# Altium schematic sheet Sch_Add.SchDoc
size A
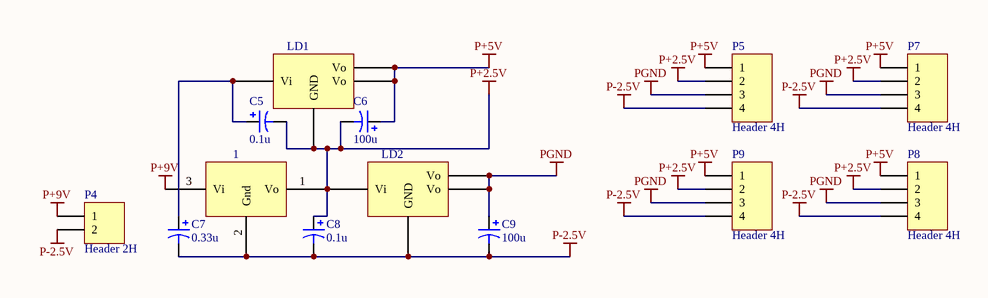
[diagram p0: Sch_Add.SchDoc]

## Parts
1  7805  [TO-92]  (value not drawn)
C5  value 0.1u  [C0805]  (hidden comment: Cap Pol3)
C6  value 100u  [C0805]  (hidden comment: Cap Pol3)
C7  value 0.33u  [C0805]  (hidden comment: Cap Pol3)
C8  value 0.1u  [C0805]  (hidden comment: Cap Pol3)
C9  value 100u  [C0805]  (hidden comment: Cap Pol3)
LD1  LD1117  [SOT230P700X180-4N]  (value not drawn)
LD2  LD1117  [SOT230P700X180-4N]  (value not drawn)
P4  Header 2H  [HDR1X2H]
P5  Header 4H  [HDR1X4H]
P7  Header 4H  [HDR1X4H]
P8  Header 4H  [HDR1X4H]
P9  Header 4H  [HDR1X4H]

## Nets
P+2.5V: 1.1(Vo) C5.2 C6.2 C8.1 LD1.1(GND) LD2.3(Vi) P5.2 P7.2 P8.2 P9.2
P+5V: C6.1 LD1.2(Vo) LD1.4(Vo) P5.1 P7.1 P8.1 P9.1
P+9V: 1.3(Vi) P4.1
P-2.5V: 1.2(Gnd) C7.2 C8.2 C9.2 LD2.1(GND) P4.2 P5.4 P7.4 P8.4 P9.4
PGND: C9.1 LD2.2(Vo) LD2.4(Vo) P5.3 P7.3 P8.3 P9.3
NetC5_1: C5.1 C7.1 LD1.3(Vi)

## Library data of the parts
C5-C9 = Cap Pol3: Polarized Capacitor (Surface Mount); Published: 8-Jun-2000; LatestRevisionDate: 29-May-2009; LatestRevisionNote: IPC-7351 Footprint Added.; PackageReference: C0805; Publisher: Altium Limited; PackageDescription: Chip Capacitor
P4 = Header 2H: Header, 2-Pin, Right Angle; LatestRevisionDate: 17-Jul-2002; LatestRevisionNote: Re-released for DXP Platform.; Publisher: Altium Limited
P5 P7-P9 = Header 4H: Header, 4-Pin, Right Angle; LatestRevisionDate: 17-Jul-2002; LatestRevisionNote: Re-released for DXP Platform.; Publisher: Altium Limited